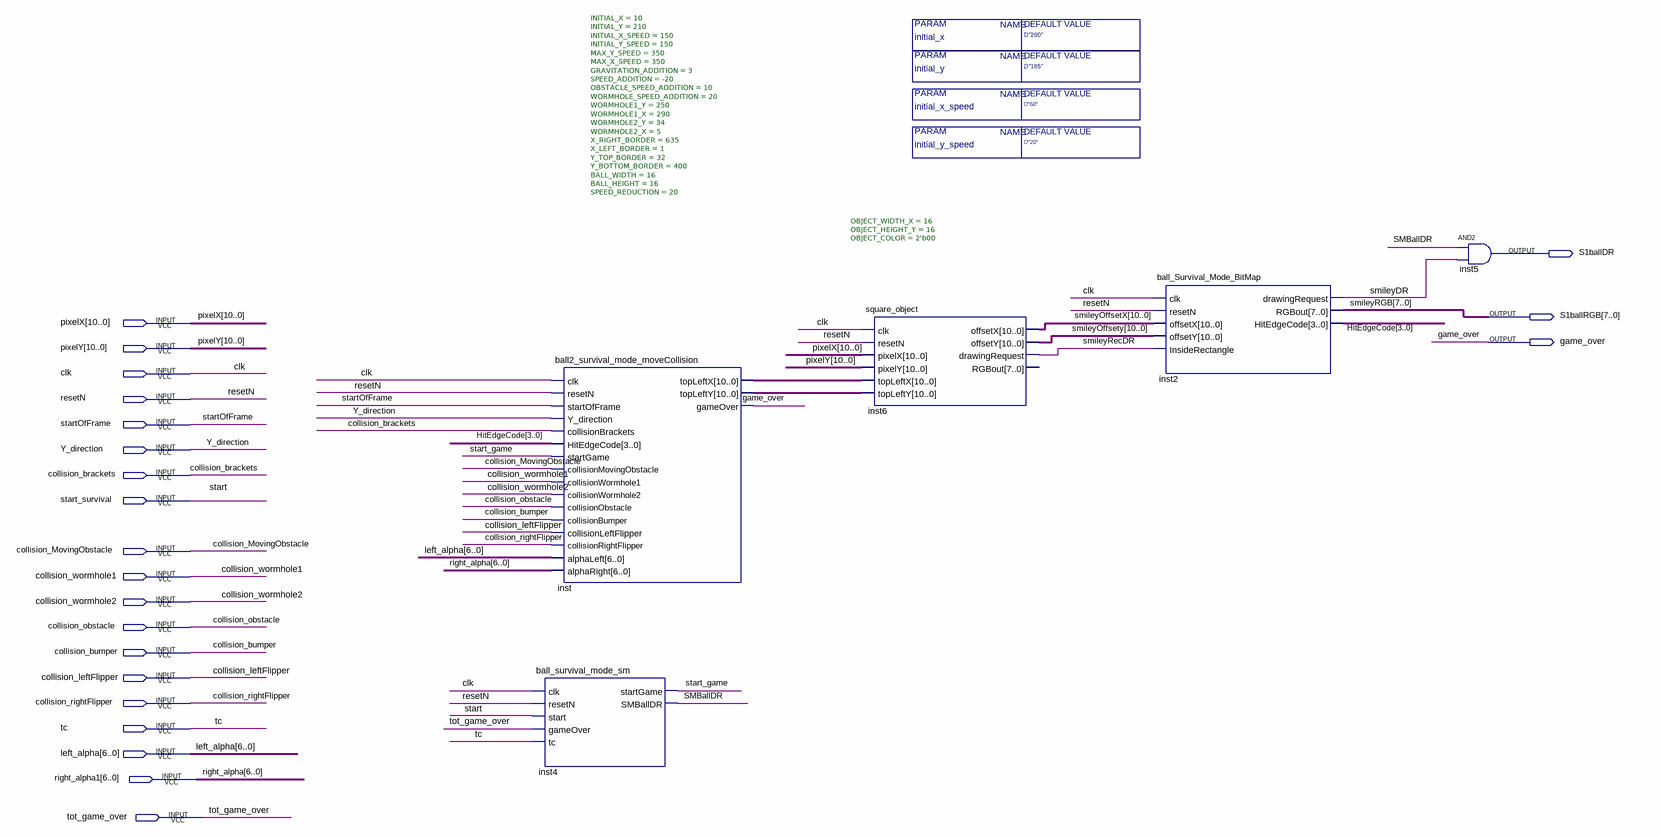
[diagram p0: schematic sheet]
// Quartus schematic ball2_survival_mode_Block.bdf as structural Verilog: 5 symbols, 22 pins
module ball2_survival_mode_Block #(parameter initial_x = "D\"280\"", parameter initial_y = "D\"185\"", parameter initial_x_speed = "D\"60\"", parameter initial_y_speed = "D\"20\"") (
  input  [10:0] pixelX,
  input  [10:0] pixelY,
  input  clk,
  input  resetN,
  input  startOfFrame,
  input  Y_direction,
  input  collision_brackets,
  input  start_survival,
  input  collision_MovingObstacle,
  input  collision_wormhole1,
  input  collision_wormhole2,
  input  collision_obstacle,
  input  collision_bumper,
  input  collision_leftFlipper,
  input  collision_rightFlipper,
  input  tc,
  input  [6:0] left_alpha,
  input  [6:0] right_alpha1,
  input  tot_game_over,
  output S1ballDR,
  output [7:0] S1ballRGB,
  output game_over
);

  wire SMBallDR, smileyDR, smileyRecDR, start_game;
  wire [3:0] HitEdgeCode;
  wire [10:0] inst_topleftx, inst_toplefty, smileyOffsetX, smileyOffsety;

  ball2_survival_mode_moveCollision #(.INITIAL_X(10), .INITIAL_Y(210), .INITIAL_X_SPEED(150), .INITIAL_Y_SPEED(150), .MAX_Y_SPEED(350), .MAX_X_SPEED(350), .GRAVITATION_ADDITION(3), .SPEED_ADDITION(-20), .OBSTACLE_SPEED_ADDITION(10), .WORMHOLE_SPEED_ADDITION(20), .WORMHOLE1_Y(250), .WORMHOLE1_X(290), .WORMHOLE2_Y(34), .WORMHOLE2_X(5), .X_RIGHT_BORDER(635), .X_LEFT_BORDER(1), .Y_TOP_BORDER(32), .Y_BOTTOM_BORDER(400), .BALL_WIDTH(16), .BALL_HEIGHT(16), .SPEED_REDUCTION(20)) inst (
    .clk(clk), .resetN(resetN), .startOfFrame(startOfFrame), .Y_direction(Y_direction),
    .collisionBrackets(collision_brackets), .HitEdgeCode(HitEdgeCode), .startGame(start_game),
    .collisionMovingObstacle(collision_MovingObstacle), .collisionWormhole1(collision_wormhole1),
    .collisionWormhole2(collision_wormhole2), .collisionObstacle(collision_obstacle),
    .collisionBumper(collision_bumper), .collisionLeftFlipper(collision_leftFlipper),
    .collisionRightFlipper(collision_rightFlipper), .alphaLeft(left_alpha), .alphaRight(right_alpha1),
    .topLeftX(inst_topleftx), .topLeftY(inst_toplefty), .gameOver(game_over));
  ball_survival_mode_sm inst4 (
    .clk(clk), .resetN(resetN), .start(start_survival), .gameOver(tot_game_over), .tc(tc),
    .startGame(start_game), .SMBallDR(SMBallDR));
  square_object #(.OBJECT_WIDTH_X(16), .OBJECT_HEIGHT_Y(16), .OBJECT_COLOR(2'b00)) inst6 (
    .clk(clk), .resetN(resetN), .pixelX(pixelX), .pixelY(pixelY), .topLeftX(inst_topleftx),
    .topLeftY(inst_toplefty), .offsetX(smileyOffsetX), .offsetY(smileyOffsety), .drawingRequest(smileyRecDR));  // open: RGBout
  ball_Survival_Mode_BitMap inst2 (
    .clk(clk), .resetN(resetN), .offsetX(smileyOffsetX), .offsetY(smileyOffsety),
    .InsideRectangle(smileyRecDR), .drawingRequest(smileyDR), .RGBout(S1ballRGB), .HitEdgeCode(HitEdgeCode));
  and inst5 (S1ballDR, SMBallDR, smileyDR);

  // Other names for the same wires on the sheet: right_alpha[6:0] = right_alpha1; smileyRGB[7:0] = S1ballRGB;
  //   start = start_survival
endmodule
